# EAGLE design filter (EAGLE 7.7.0)
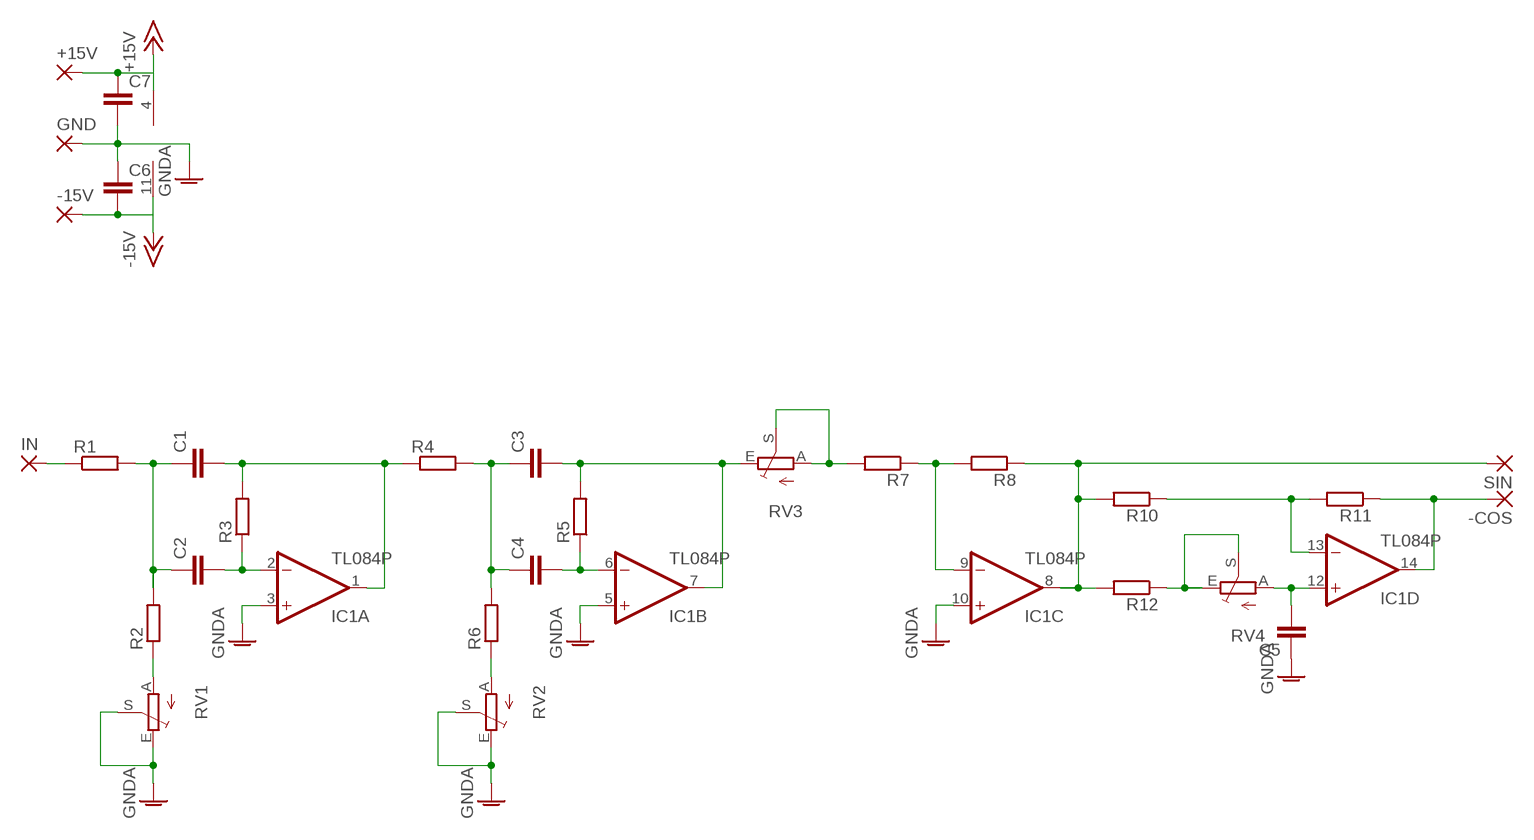
[diagram p0: schematic, sheet 1]

## Parts
+15V  2,15/1,0  [2,15/1,0]
-15V  2,15/1,0  [2,15/1,0]
-COS  2,15/1,0  [2,15/1,0]
C1  C-EU025-025X050  [C025-025X050]
C2  C-EU025-025X050  [C025-025X050]
C3  C-EU025-025X050  [C025-025X050]
C4  C-EU025-025X050  [C025-025X050]
C5  C-EU025-025X050  [C025-025X050]
C6  C-EU050-030X075  [C050-030X075]
C7  C-EU050-030X075  [C050-030X075]
GND  2,15/1,0  [2,15/1,0]
IC1  TL084P  [DIL14]
IN  2,15/1,0  [2,15/1,0]
R1  R-EU_0309/V  [0309V]
R2  R-EU_0309/V  [0309V]
R3  R-EU_0309/V  [0309V]
R4  R-EU_0309/V  [0309V]
R5  R-EU_0309/V  [0309V]
R6  R-EU_0309/V  [0309V]
R7  R-EU_0309/V  [0309V]
R8  R-EU_0309/V  [0309V]
R10  R-EU_0309/V  [0309V]
R11  R-EU_0309/V  [0309V]
R12  R-EU_0309/V  [0309V]
RV1  TRIM_EU-RJ9W  [RJ9W]
RV2  TRIM_EU-RJ9W  [RJ9W]
RV3  TRIM_EU-RJ9W  [RJ9W]
RV4  TRIM_EU-RJ9W  [RJ9W]
SIN  2,15/1,0  [2,15/1,0]

## Nets
+15V: +15V.1(P) C7.1 IC1.4(P:V+)
-15V: -15V.1(P) C6.2 IC1.11(P:V-)
GNDA: C5.1 C6.1 C7.2 GND.1(P) IC1.3(A:+IN) IC1.5(B:+IN) IC1.10(C:+IN) RV1.E RV1.S RV2.E RV2.S
N$1: R2.1 RV1.A
N$2: C1.1 C2.1 R1.2 R2.2
N$3: -COS.1(P) IC1.14(D:OUT) R11.1
N$4: C1.2 IC1.1(A:OUT) R3.2 R4.1
N$5: C2.2 IC1.2(A:-IN) R3.1
N$6: IN.1(P) R1.1
N$7: R6.1 RV2.A
N$8: C3.1 C4.1 R4.2 R6.2
N$9: C3.2 IC1.7(B:OUT) R5.2 RV3.E
N$10: C4.2 IC1.6(B:-IN) R5.1
N$11: R7.2 RV3.A RV3.S
N$12: IC1.9(C:-IN) R7.1 R8.2
N$13: IC1.8(C:OUT) R8.1 R10.2 R12.2 SIN.1(P)
N$14: IC1.13(D:-IN) R10.1 R11.2
N$15: R12.1 RV4.E RV4.S
N$16: C5.2 IC1.12(D:+IN) RV4.A

## Library data of the parts
+15V -15V -COS GND IN SIN = wirepad:2,15/1,0: THROUGH-HOLE PAD
C1-C7 = rcl:C-EU: CAPACITOR, European symbol
IC1 = linear:TL084: OP AMP
R1-R8 R10-R12 = rcl:R-EU_: RESISTOR, European symbol
RV1-RV4 = pot:TRIM_EU-: POTENTIOMETER

## Board
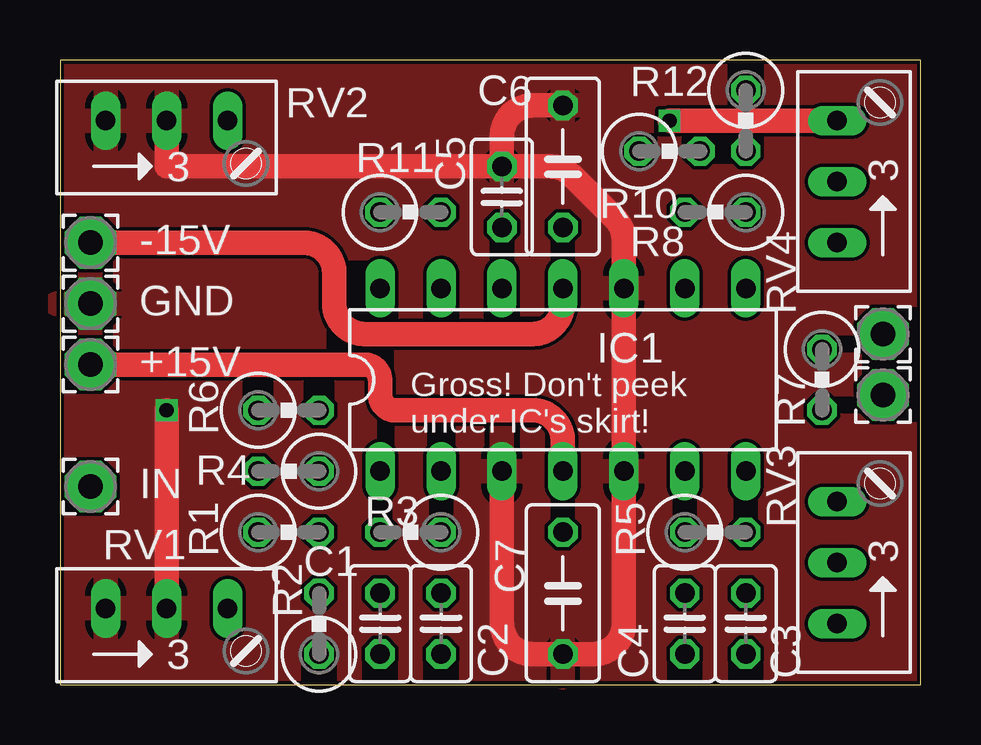
[diagram p1: board, top side]
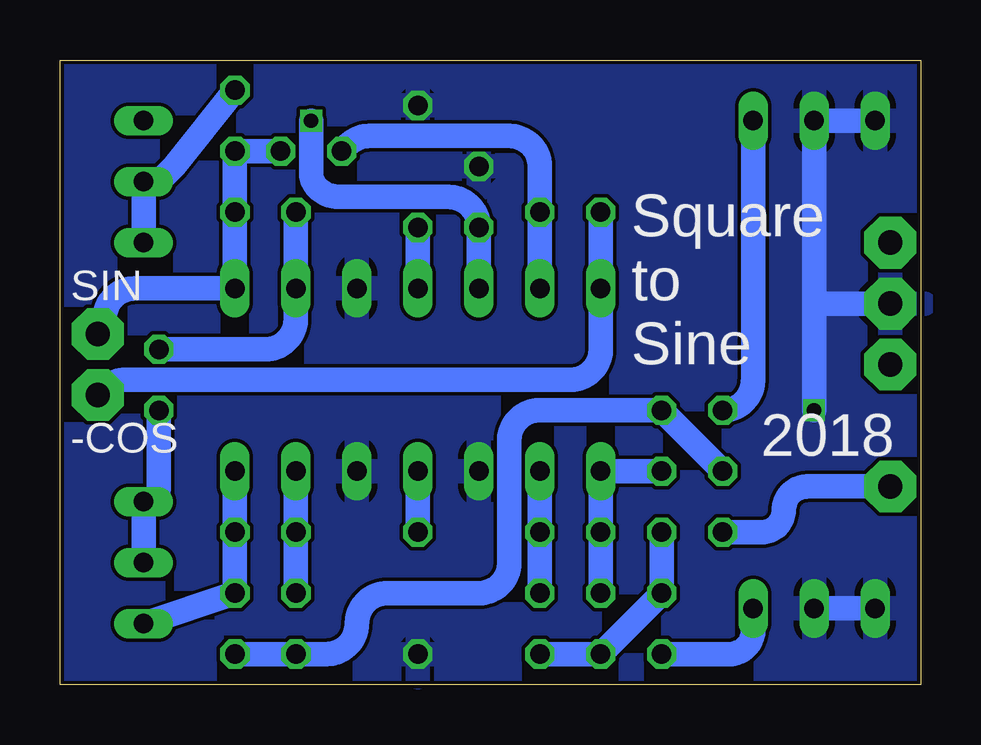
[diagram p2: board, bottom side, seen from below]

Size 35.87 x 26.02 mm. Coordinates in mm from the lower left corner, seen from the top.
Outline: 0,0 35.87,0 35.87,26.02 0,26.02 0,0
Copper layers (1*16): Top 0.035mm / dielectric 1.5mm / Bottom 0.035mm
Design rules "PCWway": minimum track width 6mil, minimum drill 0.3mm, track to track 6mil, track to pad 6mil, pad to pad 6mil, via to via 6mil, smd to smd 6mil, copper to edge 6mil, drill to drill 8mil, minimum pad ring 6mil, minimum via ring 6mil, stop-mask expansion 4mil, vias tented up to drill 0mil, thermal gap 10mil

### Footprints (pad centres in the part's own frame; a part is rotated, then mirrored left to right if it is on the bottom)
2,15/1,0 = drill 1.016 pad 2.159 octagon: 1 0,0
C025-025X050 = drill 0.813 octagon: 1 -1.27,0; 2 1.27,0
C050-030X075 = drill 0.813 octagon: 1 -2.54,0; 2 2.54,0
DIL14 = drill 0.813 long: 1 -7.62,-3.81; 2 -5.08,-3.81; 3 -2.54,-3.81; 4 0,-3.81; 5 2.54,-3.81; 6 5.08,-3.81; 7 7.62,-3.81; 8 7.62,3.81; 9 5.08,3.81; 10 2.54,3.81; 11 0,3.81; 12 -2.54,3.81; 13 -5.08,3.81; 14 -7.62,3.81
0309V = drill 0.813 octagon: 1 -1.27,0; 2 1.27,0
RJ9W = drill 0.813 long: A 2.54,0.635; E -2.54,0.635; S 0,0.635

### Placement (x,y rotation side)
+15V  1.27,13.34 0 top
-15V  1.27,18.41 0 top
-COS  34.29,12.06 0 top
C1  13.34,2.54 90 top
C2  15.88,2.54 90 top
C3  28.57,2.54 90 top
C4  26.04,2.54 90 top
C5  18.41,20.32 270 top
C6  20.95,21.59 270 top
C7  20.95,3.81 270 top
GND  1.27,15.88 0 top
IC1  20.95,12.7 0 top
IN  1.27,8.26 0 top
R1  9.53,6.35 0 top
R2  10.79,2.54 90 top
R3  14.61,6.35 180 top
R4  9.53,8.89 180 top
R5  27.3,6.35 0 top
R6  9.53,11.43 0 top
R7  31.75,12.7 270 top
R8  27.3,19.68 180 top
R10  25.4,22.23 0 top
R11  14.61,19.68 0 top
R12  28.57,23.5 270 top
RV1  4.45,2.54 0 top
RV2  4.45,22.86 0 top
RV3  33.02,5.08 90 top
RV4  33.02,20.95 90 top
SIN  34.29,14.61 0 top

### Tracks (layer width: path | path; a pad name or v marks a point on that pad's centre or on a via)
+15V
  Top 1.016: +15V.1 12.7,13.34 arc-90 13.34,12.7 13.34,12.06 arc90 13.97,11.43 19.68,11.43 arc-90 20.95,10.16 IC1.4
  Bottom 1.016: C7.1 IC1.4
-15V
  Top 1.016: -15V.1 10.16,18.41 arc-90 11.43,17.14 11.43,15.88 arc90 12.7,14.61 19.68,14.61 arc90 20.95,15.88 IC1.11
  Bottom 1.016: IC1.11 C6.2
GNDA  (via drill 0.6)
  Top 1.016: IC1.3 18.41,2.54 arc90 19.68,1.27 C7.2 22.23,1.27 arc90 23.5,2.54 IC1.5 IC1.10 23.5,18.52 arc45 23.12,19.42 21.33,21.22 arc45 20.43,21.59 C5.1 | C5.1 4.45,21.59 RV2.S | RV1.S v4.45,11.43 | C5.1 18.41,22.86 arc-90 19.68,24.13 C6.1
  Bottom 1.016: RV2.E RV2.S 4.45,15.88 | GND.1 4.45,15.88 | RV1.S RV1.E | v4.45,11.43 4.45,15.88
  pour Top (isolate 0.127): 0,26.04 35.88,26.04 35.88,0 0,0
  pour Bottom (isolate 0.127): 0,26.04 35.88,26.04 35.88,0 0,0
N$1
  Bottom 1.016: R2.1 7.99,1.27 arc-90 6.99,2.27 RV1.A
N$2
  Bottom 1.016: C2.1 C1.1 R2.2 R1.2
N$3
  Bottom 1.016: -COS.1 34.03,12.33 arc45 33.13,12.7 14.61,12.7 arc-90 13.34,13.97 IC1.14 R11.1
N$4
  Bottom 1.016: C1.2 R3.2 IC1.1 R4.1
N$5
  Bottom 1.016: C2.2 R3.1 IC1.2
N$6
  Bottom 1.016: IN.1 4.71,8.26 arc-90 5.71,7.25 arc90 6.62,6.35 R1.1
N$7
  Bottom 1.016: R6.1 arc-90 6.99,12.7 RV2.A
N$8
  Bottom 1.016: C3.1 C4.1 24.77,1.27 arc-90 23.5,2.54 arc90 22.23,3.81 18.41,3.81 arc-90 17.14,5.08 17.14,10.16 arc90 15.88,11.43 R6.2 R4.2
N$9
  Bottom 1.016: IC1.7 R5.2 C3.2 RV3.E
N$10
  Bottom 1.016: C4.2 R5.1 IC1.6
N$11
  Bottom 1.016: RV3.S RV3.A arc-90 31.75,8.26 R7.2
N$12
  Bottom 1.016: R7.1 27.3,13.97 arc-90 26.04,15.24 IC1.9 R8.2
N$13
  Bottom 1.016: SIN.1 33.94,15.64 arc72 32.74,16.51 IC1.8 R8.1 R12.2 R10.2
N$14
  Bottom 1.016: IC1.13 R11.2 15.88,21.59 arc-90 17.14,22.86 22.97,22.86 arc-45 23.87,22.49 R10.1
N$15
  Bottom 1.016: RV4.E RV4.S 31.75,20.95 31.11,21.59 R12.1
N$16  (via drill 0.6)
  Top 1.016: v25.4,23.5 RV4.A
  Bottom 1.016: IC1.12 C5.2 arc-90 19.68,20.32 24.24,20.32 arc45 25.14,20.69 arc45 25.4,21.33 v25.4,23.5

### Text on the board
tNames: Gross! Don't peek / under IC's skirt!
bNames: Square / to / Sine | 2018